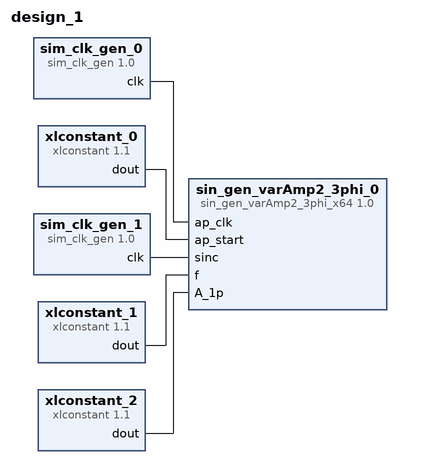
[diagram p0: block diagram of the top level]
# Vivado block design design_1, xc7a200tfbg676-2, Vivado 2020.2
create_bd_design design_1

create_bd_cell -type ip -vlnv xilinx.com:ip:sim_clk_gen:1.0 sim_clk_gen_0
create_bd_cell -type ip -vlnv xilinx.com:ip:sim_clk_gen:1.0 sim_clk_gen_1
set_property -dict {CONFIG.FREQ_HZ 1000000} [get_bd_cells sim_clk_gen_1]
create_bd_cell -type ip -vlnv xilinx.com:ip:xlconstant:1.1 xlconstant_0
create_bd_cell -type ip -vlnv xilinx.com:ip:xlconstant:1.1 xlconstant_1
set_property -dict {CONFIG.CONST_VAL 0x3c000000000000 CONFIG.CONST_WIDTH 64} [get_bd_cells xlconstant_1]
create_bd_cell -type ip -vlnv xilinx.com:ip:xlconstant:1.1 xlconstant_2
set_property -dict {CONFIG.CONST_VAL 0x1e000000000000 CONFIG.CONST_WIDTH 64} [get_bd_cells xlconstant_2]
create_bd_cell -type ip -vlnv xilinx.com:user:sin_gen_varAmp2_3phi_x64:1.0 sin_gen_varAmp2_3phi_0

# ---- connections ----

connect_bd_net [get_bd_pins sim_clk_gen_0/clk] [get_bd_pins sin_gen_varAmp2_3phi_0/ap_clk]
connect_bd_net [get_bd_pins xlconstant_0/dout] [get_bd_pins sin_gen_varAmp2_3phi_0/ap_start]
connect_bd_net [get_bd_pins sim_clk_gen_1/clk] [get_bd_pins sin_gen_varAmp2_3phi_0/sinc]
connect_bd_net [get_bd_pins xlconstant_1/dout] [get_bd_pins sin_gen_varAmp2_3phi_0/f]
connect_bd_net [get_bd_pins xlconstant_2/dout] [get_bd_pins sin_gen_varAmp2_3phi_0/A_1p]

validate_bd_design
save_bd_design
